# Altium schematic sheet RELAY4.SchDoc
size A
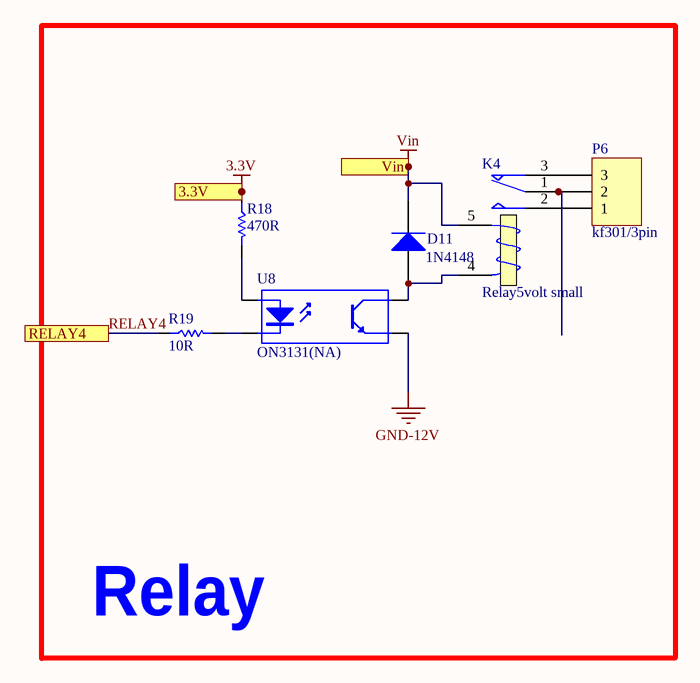
[diagram p0: RELAY4.SchDoc]

## Parts
D11  1N4148  [sod123]
K4  Relay5volt small  [relay5_childern]
P6  kf301/3pin  [Blue Connector 1*3 -kf301]
R18  470R  [0805/resistor]
R19  10R  [0805/resistor]
U8  ON3131(NA)  [OPTO_COUPLER]

## Blocks framed on the sheet
Relay: D11 K4 P6 R18 R19 U8

## Ports
3.3V, RELAY4, Vin

## Nets
3.3V: R18.1 ; port 3.3V
GND-12V: U8.3(E)
Vin: D11.K K4.5 ; port Vin
RELAY4: R19.1 ; port RELAY4
NetD11_A: D11.A K4.4(T2) U8.4(C)
NetK4_1: K4.1(COM) P6.2
NetK4_2: K4.2(NO) P6.1
NetK4_3: K4.3(T1) P6.3
NetR18_2: R18.2 U8.1(A)
NetR19_2: R19.2 U8.2(K)

## Library data of the parts
D11 = Diode 1N4007: 1 Amp General Purpose Rectifier; Published: 8-Jun-2000; LatestRevisionDate: 17-Jul-2002; LatestRevisionNote: Re-released for DXP Platform.; DatasheetVersion: 1998; PackageVersion: Aug-1999; PackageReference: DO-41; Publisher: Altium Limited; PackageDescription: Diode, Axial; Body 5.2 x 2.7 mm (LxDia. max), Lead Dia. 0.86 mm (max); Code_JEDEC: DO-204-AL; ComponentLink1Description: Manufacturer Link; ComponentLink1URL: http://www.fairchildsemi.com/; ComponentLink2Description: Datasheet; ComponentLink2URL: http://www.fairchildsemi.com/ds/1N%2F1N4001.pdf
K4 = Relay: SPDT Relay; Published: 8-Jun-2000; LatestRevisionDate: 17-Jul-2002; LatestRevisionNote: Re-released for DXP Platform.; PackageReference: MODULE5B; Publisher: Altium Limited
P6 = Header 3: LatestRevisionDate: 17-Jul-2002; LatestRevisionNote: Re-released for DXP Platform.; Publisher: Altium Limited
R18 R19 = Resistor: Tolerance: 5%; Power: 1/8 W
  R18: Value: 470R
  R19: Value: 10R
U8 = Optoisolator1: 4-Pin Phototransistor Optocoupler; Published: 24-Mar-1999; LatestRevisionDate: 04-Mar-2005; LatestRevisionNote: Sch pins 3 & 4 Swapped.; DatasheetVersion: Nov-2003; PackageReference: DIP-4; Publisher: Altium Limited